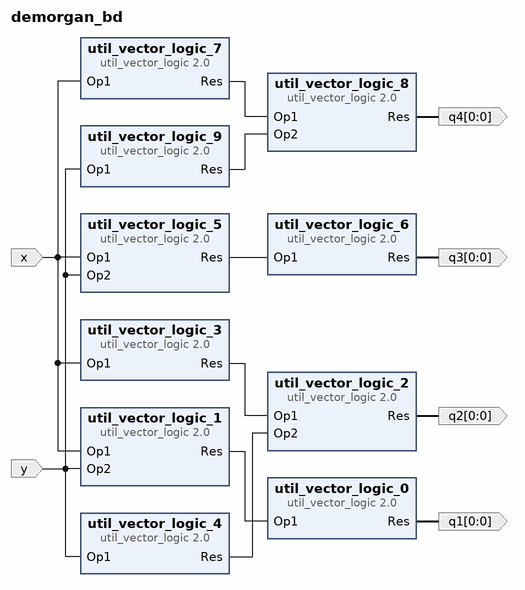
[diagram p0: block diagram of the top level]
# Vivado block design demorgan_bd, xc7a100tfgg484-1, Vivado 2017.4
create_bd_design demorgan_bd

create_bd_port -dir I x
create_bd_port -dir I y
create_bd_port -dir O -from 0 -to 0 q1
create_bd_port -dir O -from 0 -to 0 q2
create_bd_port -dir O -from 0 -to 0 q3
create_bd_port -dir O -from 0 -to 0 q4

create_bd_cell -type ip -vlnv xilinx.com:ip:util_vector_logic:2.0 util_vector_logic_0
set_property -dict {CONFIG.C_SIZE 1 CONFIG.C_OPERATION not} [get_bd_cells util_vector_logic_0]
create_bd_cell -type ip -vlnv xilinx.com:ip:util_vector_logic:2.0 util_vector_logic_1
set_property -dict {CONFIG.C_SIZE 1 CONFIG.C_OPERATION or} [get_bd_cells util_vector_logic_1]
create_bd_cell -type ip -vlnv xilinx.com:ip:util_vector_logic:2.0 util_vector_logic_2
set_property -dict {CONFIG.C_SIZE 1} [get_bd_cells util_vector_logic_2]
create_bd_cell -type ip -vlnv xilinx.com:ip:util_vector_logic:2.0 util_vector_logic_3
set_property -dict {CONFIG.C_SIZE 1 CONFIG.C_OPERATION not} [get_bd_cells util_vector_logic_3]
create_bd_cell -type ip -vlnv xilinx.com:ip:util_vector_logic:2.0 util_vector_logic_4
set_property -dict {CONFIG.C_SIZE 1 CONFIG.C_OPERATION not} [get_bd_cells util_vector_logic_4]
create_bd_cell -type ip -vlnv xilinx.com:ip:util_vector_logic:2.0 util_vector_logic_5
set_property -dict {CONFIG.C_SIZE 1} [get_bd_cells util_vector_logic_5]
create_bd_cell -type ip -vlnv xilinx.com:ip:util_vector_logic:2.0 util_vector_logic_6
set_property -dict {CONFIG.C_SIZE 1 CONFIG.C_OPERATION not} [get_bd_cells util_vector_logic_6]
create_bd_cell -type ip -vlnv xilinx.com:ip:util_vector_logic:2.0 util_vector_logic_7
set_property -dict {CONFIG.C_SIZE 1 CONFIG.C_OPERATION not} [get_bd_cells util_vector_logic_7]
create_bd_cell -type ip -vlnv xilinx.com:ip:util_vector_logic:2.0 util_vector_logic_8
set_property -dict {CONFIG.C_SIZE 1 CONFIG.C_OPERATION or} [get_bd_cells util_vector_logic_8]
create_bd_cell -type ip -vlnv xilinx.com:ip:util_vector_logic:2.0 util_vector_logic_9
set_property -dict {CONFIG.C_SIZE 1 CONFIG.C_OPERATION not} [get_bd_cells util_vector_logic_9]

# ---- connections ----

connect_bd_net [get_bd_pins util_vector_logic_1/Res] [get_bd_pins util_vector_logic_0/Op1]
connect_bd_net [get_bd_pins util_vector_logic_3/Res] [get_bd_pins util_vector_logic_2/Op1]
connect_bd_net [get_bd_pins util_vector_logic_4/Res] [get_bd_pins util_vector_logic_2/Op2]
connect_bd_net [get_bd_pins util_vector_logic_5/Res] [get_bd_pins util_vector_logic_6/Op1]
connect_bd_net [get_bd_pins util_vector_logic_7/Res] [get_bd_pins util_vector_logic_8/Op1]
connect_bd_net [get_bd_pins util_vector_logic_9/Res] [get_bd_pins util_vector_logic_8/Op2]
connect_bd_net [get_bd_ports x] \
  [get_bd_pins util_vector_logic_1/Op1] [get_bd_pins util_vector_logic_3/Op1] [get_bd_pins util_vector_logic_5/Op1] \
  [get_bd_pins util_vector_logic_7/Op1]
connect_bd_net [get_bd_ports y] \
  [get_bd_pins util_vector_logic_1/Op2] [get_bd_pins util_vector_logic_4/Op1] [get_bd_pins util_vector_logic_5/Op2] \
  [get_bd_pins util_vector_logic_9/Op1]
connect_bd_net [get_bd_pins util_vector_logic_0/Res] [get_bd_ports q1]
connect_bd_net [get_bd_pins util_vector_logic_2/Res] [get_bd_ports q2]
connect_bd_net [get_bd_pins util_vector_logic_6/Res] [get_bd_ports q3]
connect_bd_net [get_bd_pins util_vector_logic_8/Res] [get_bd_ports q4]

validate_bd_design
save_bd_design
